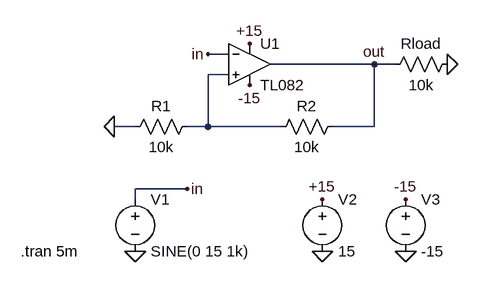
[diagram p0: schematic trigger_schmitt.asc]
trigger_schmitt.asc, the LTspice schematic file:
Version 4
SHEET 1 880 680
WIRE 160 80 128 80
WIRE 384 96 224 96
WIRE 416 96 384 96
WIRE 160 112 128 112
WIRE 16 192 -16 192
WIRE 128 192 128 112
WIRE 128 192 96 192
WIRE 240 192 128 192
WIRE 384 192 384 96
WIRE 384 192 320 192
WIRE 96 288 16 288
WIRE 16 304 16 288
FLAG 304 384 0
FLAG 432 384 0
FLAG 304 304 +15
FLAG 432 304 -15
FLAG 16 384 0
FLAG 192 64 +15
FLAG 192 128 -15
FLAG -16 192 0
FLAG 496 96 0
FLAG 384 96 out
FLAG 96 288 in
FLAG 128 80 in
SYMBOL voltage 16 288 R0
WINDOW 123 0 0 Left 0
WINDOW 39 0 0 Left 0
SYMATTR InstName V1
SYMATTR Value SINE(0 15 1k)
SYMBOL voltage 304 288 R0
WINDOW 123 0 0 Left 0
WINDOW 39 0 0 Left 0
SYMATTR InstName V2
SYMATTR Value 15
SYMBOL voltage 432 288 R0
WINDOW 123 0 0 Left 0
WINDOW 39 0 0 Left 0
SYMATTR InstName V3
SYMATTR Value -15
SYMBOL TL082 192 96 R0
SYMATTR InstName U1
SYMBOL res 112 176 R90
WINDOW 0 0 56 VBottom 2
WINDOW 3 32 56 VTop 2
SYMATTR InstName R1
SYMATTR Value 10k
SYMBOL res 336 176 R90
WINDOW 0 0 56 VBottom 2
WINDOW 3 32 56 VTop 2
SYMATTR InstName R2
SYMATTR Value 10k
SYMBOL res 512 80 R90
WINDOW 0 0 56 VBottom 2
WINDOW 3 32 56 VTop 2
SYMATTR InstName Rload
SYMATTR Value 10k
TEXT -160 384 Left 2 !.tran 5m

The netlist it stands for:
* trigger_schmitt.asc
V1 in 0 SINE(0 15 1k)
V2 +15 0 15
V3 -15 0 -15
* U1: TL082 (symbol TL082 not available, pins judged from their places): In+=N001 In-=in V+=+15 V-=-15 OUT=out
R1 N001 0 10k
R2 out N001 10k
Rload 0 out 10k
.tran 5m
.backanno
.end